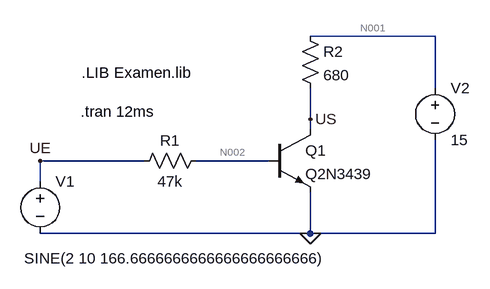
[diagram p0: schematic Parte2.asc]
Parte2.asc, the LTspice schematic file:
Version 4
SHEET 1 68488 105432
WIRE 68432 105072 68240 105072
WIRE 68432 105152 68432 105072
WIRE 68240 105200 68240 105152
WIRE 68240 105216 68240 105200
WIRE 67984 105264 67824 105264
WIRE 68176 105264 68064 105264
WIRE 67824 105296 67824 105264
WIRE 68240 105376 68240 105312
WIRE 68240 105376 67824 105376
WIRE 68432 105376 68432 105232
WIRE 68432 105376 68240 105376
FLAG 68240 105200 US
FLAG 68240 105376 0
FLAG 67824 105264 UE
SYMBOL res 68080 105248 R90
WINDOW 0 0 56 VBottom 2
WINDOW 3 32 56 VTop 2
SYMATTR InstName R1
SYMATTR Value 47k
SYMBOL npn 68176 105216 R0
SYMATTR InstName Q1
SYMATTR Value Q2N3439
SYMBOL res 68224 105056 R0
SYMATTR InstName R2
SYMATTR Value 680
SYMBOL voltage 67824 105280 R0
WINDOW 3 -25 134 Left 2
WINDOW 123 0 0 Left 0
WINDOW 39 0 0 Left 0
SYMATTR InstName V1
SYMATTR Value SINE(2 10 166.6666666666666666666666)
SYMBOL voltage 68432 105136 R0
WINDOW 123 0 0 Left 0
WINDOW 39 0 0 Left 0
SYMATTR InstName V2
SYMATTR Value 15
TEXT 67886 105188 Left 2 !.tran 12ms
TEXT 67888 105128 Left 2 !.LIB Examen.lib

The netlist it stands for:
* Parte2.asc
R1 N002 UE 47k
Q1 US N002 0 0 Q2N3439
R2 N001 US 680
V1 UE 0 SINE(2 10 166.6666666666666666666666)
V2 N001 0 15
.model NPN NPN
.model PNP PNP
.lib standard.bjt
.tran 12ms
.LIB Examen.lib
.backanno
.end

* Results of the author's LTspice run, read from the files saved beside the schematic
* Operating Point, zero values left out:
*   V(n002) = 525.5 mV
*   V(ue) = 2 V
*   V(us) = 13.72 V
*   V(n001) = 15 V
*   Ic(Q1) = 1.887 mA
*   Ib(Q1) = 31.37 µA
*   Ie(Q1) = -1.918 mA
*   I(R2) = 1.887 mA
*   I(R1) = -31.37 µA
*   I(V2) = -1.887 mA
*   I(V1) = -31.37 µA